# Altium schematic sheet STM32单片机最小系统.SchDoc
size A4
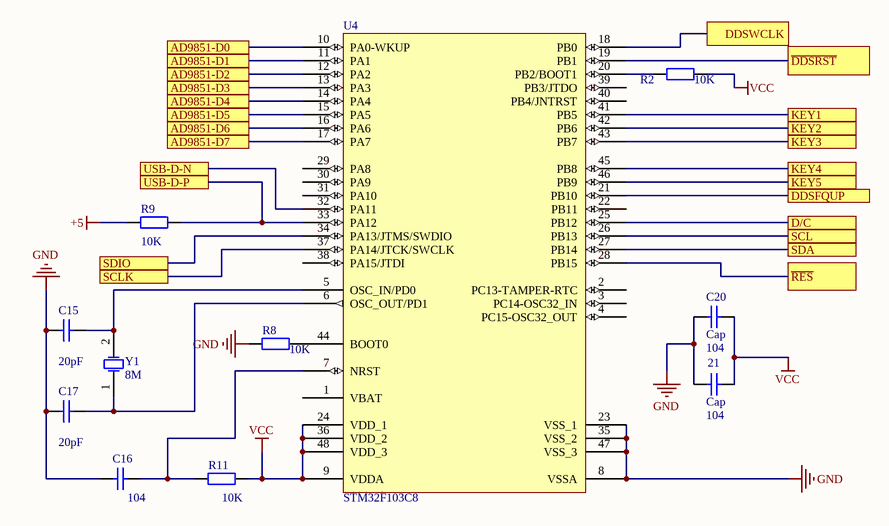
[diagram p0: STM32单片机最小系统.SchDoc]

## Parts
21  Cap  value 104  [C0805]
C15  value 20pF  [C0805]  (hidden comment: Cap)
C16  value 104  [C0805]  (hidden comment: Cap)
C17  value 20pF  [C0805]  (hidden comment: Cap)
C20  Cap  value 104  [C0805]
R2  value 10K  [6-0805_N]  (hidden comment: Res2)
R8  value 10K  [6-0805_N]  (hidden comment: Res2)
R9  10k  [6-0805_N]
R11  value 10K  [6-0805_N]  (hidden comment: Res2)
U4  STM32F103C8  [TQFP-48]
Y1  8M  [XTAL2]

## Ports
AD9851-D0, AD9851-D1, AD9851-D2, AD9851-D3, AD9851-D4, AD9851-D5, AD9851-D6, AD9851-D7, D/C, DDSFQUP, DDSWCLK, KEY1, KEY2, KEY3, KEY4, KEY5, SCL, SCLK, SDA, SDIO, USB-D-N, USB-D-P, ~{DDSRST}, ~{RES}

## Nets
+5: R9.2
GND: 21.2 C15.2 C16.1 C17.2 C20.2 R8.2 U4.8(VSSA) U4.23(VSS_1) U4.35(VSS_2) U4.47(VSS_3)
VCC: 21.1 C20.1 R2.1 R11.2 U4.9(VDDA) U4.24(VDD_1) U4.36(VDD_2) U4.48(VDD_3)
AD9851-D0: U4.10(PA0-WKUP) ; port AD9851-D0
AD9851-D1: U4.11(PA1) ; port AD9851-D1
AD9851-D2: U4.12(PA2) ; port AD9851-D2
AD9851-D3: U4.13(PA3) ; port AD9851-D3
AD9851-D4: U4.14(PA4) ; port AD9851-D4
AD9851-D5: U4.15(PA5) ; port AD9851-D5
AD9851-D6: U4.16(PA6) ; port AD9851-D6
AD9851-D7: U4.17(PA7) ; port AD9851-D7
D/C: U4.25(PB12) ; port D/C
~{DDSRST}: U4.19(PB1) ; port ~{DDSRST}
DDSFQUP: U4.21(PB10) ; port DDSFQUP
DDSWCLK: U4.18(PB0) ; port DDSWCLK
KEY1: U4.41(PB5) ; port KEY1
KEY2: U4.42(PB6) ; port KEY2
KEY3: U4.43(PB7) ; port KEY3
KEY4: U4.45(PB8) ; port KEY4
KEY5: U4.46(PB9) ; port KEY5
~{RES}: U4.28(PB15) ; port ~{RES}
SCL: U4.26(PB13) ; port SCL
SCLK: U4.37(PA14/JTCK/SWCLK) ; port SCLK
SDA: U4.27(PB14) ; port SDA
SDIO: U4.34(PA13/JTMS/SWDIO) ; port SDIO
USB-D-N: U4.32(PA11) ; port USB-D-N
USB-D-P: R9.1 U4.33(PA12) ; port USB-D-P
NetC15_1: C15.1 U4.5(OSC_IN/PD0) Y1.2(OSC2)
NetC16_2: C16.2 R11.1 U4.7(NRST)
NetC17_1: C17.1 U4.6(OSC_OUT/PD1) Y1.1(OSC1)
NetR2_2: R2.2 U4.20(PB2/BOOT1)
NetR8_1: R8.1 U4.44(BOOT0)

Not connected (* = marked no-connect by the designer): U4 1(VBAT) 2(PC13-TAMPER-RTC) 3(PC14-OSC32_IN) 4(PC15-OSC32_OUT) 22(PB11) 29(PA8) 30(PA9) 31(PA10) 38(PA15/JTDI) 39(PB3/JTDO) 40(PB4/JNTRST)

## Library data of the parts
21 C15-C17 C20 = Cap: Capacitor; Published: 8-Jun-2000; LatestRevisionDate: 17-Jul-2002; LatestRevisionNote: Re-released for DXP Platform.; PackageReference: RAD-0.3; Publisher: Altium Limited; PackageDescription: Radial Cap, Thru-Hole; 2 Leads; 0.3 in Pin Spacing
R2 R8 R9 R11 = Res2: Resistor; Published: 8-Jun-2000; LatestRevisionDate: 17-Jul-2002; LatestRevisionNote: Re-released for DXP Platform.; PackageReference: AXIAL-0.4; Publisher: Altium Limited; PackageDescription: Axial Device, Thru-Hole; 2 Leads; 0.4 in Pin Spacing
  R9: Value: 10K
U4 = STM32F103C8: Flaah:64/RAM:20/IO:36; BOM名称: 32位STM单片机; 版权归属: 源创客; 学习资源: www.ooocke.com
Y1 = XTAL: Crystal Oscillator; Published: 8-Jun-2000; LatestRevisionDate: 17-Jul-2002; LatestRevisionNote: Re-released for DXP Platform.; PackageReference: R38; Publisher: Altium Limited; PackageDescription: Crystal, Thru-Hole; 2 Leads; Body 3.1 x 8.2 mm (Dia.xH)